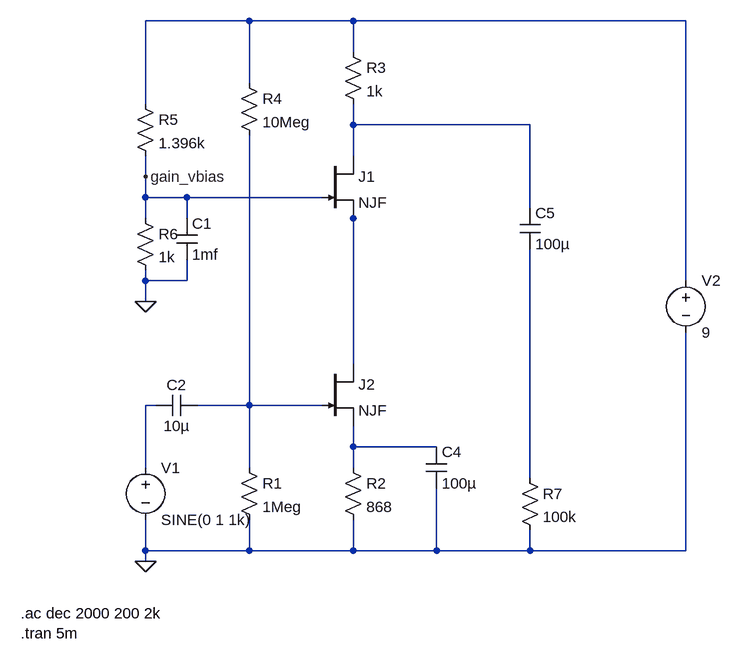
[diagram p0: schematic mixer_jfet_cascode.asc]
mixer_jfet_cascode.asc, the LTspice schematic file:
Version 4
SHEET 1 956 852
WIRE 224 -96 64 -96
WIRE 384 -96 224 -96
WIRE 896 -96 384 -96
WIRE 384 -48 384 -96
WIRE 224 0 224 -96
WIRE 64 32 64 -96
WIRE 384 64 384 32
WIRE 656 64 384 64
WIRE 384 112 384 64
WIRE 64 144 64 112
WIRE 64 176 64 144
WIRE 128 176 64 176
WIRE 336 176 128 176
WIRE 656 192 656 64
WIRE 64 208 64 176
WIRE 128 208 128 176
WIRE 384 208 384 192
WIRE 64 304 64 288
WIRE 128 304 128 272
WIRE 128 304 64 304
WIRE 896 304 896 -96
WIRE 64 336 64 304
WIRE 384 432 384 208
WIRE 80 496 64 496
WIRE 224 496 224 80
WIRE 224 496 144 496
WIRE 336 496 224 496
WIRE 384 560 384 528
WIRE 512 560 384 560
WIRE 64 592 64 496
WIRE 224 592 224 496
WIRE 384 592 384 560
WIRE 656 608 656 256
WIRE 64 720 64 672
WIRE 224 720 224 672
WIRE 224 720 64 720
WIRE 384 720 384 672
WIRE 384 720 224 720
WIRE 512 720 512 624
WIRE 512 720 384 720
WIRE 656 720 656 688
WIRE 656 720 512 720
WIRE 896 720 896 384
WIRE 896 720 656 720
WIRE 64 736 64 720
FLAG 64 336 0
FLAG 64 736 0
FLAG 64 144 gain_vbias
SYMBOL cap 112 208 R0
SYMATTR InstName C1
SYMATTR Value 1mf
SYMBOL cap 144 480 R90
WINDOW 0 0 32 VBottom 2
WINDOW 3 32 32 VTop 2
SYMATTR InstName C2
SYMATTR Value 10µ
SYMBOL cap 496 560 R0
SYMATTR InstName C4
SYMATTR Value 100µ
SYMBOL cap 640 192 R0
SYMATTR InstName C5
SYMATTR Value 100µ
SYMBOL res 208 576 R0
SYMATTR InstName R1
SYMATTR Value 1Meg
SYMBOL voltage 64 576 R0
SYMATTR InstName V1
SYMATTR Value SINE(0 1 1k)
SYMATTR Value2 AC 1
SYMBOL res 368 576 R0
SYMATTR InstName R2
SYMATTR Value 868
SYMBOL res 368 -64 R0
SYMATTR InstName R3
SYMATTR Value 1k
SYMBOL res 208 -16 R0
SYMATTR InstName R4
SYMATTR Value 10Meg
SYMBOL res 48 16 R0
SYMATTR InstName R5
SYMATTR Value 1.396k
SYMBOL res 48 192 R0
SYMATTR InstName R6
SYMATTR Value 1k
SYMBOL res 640 592 R0
SYMATTR InstName R7
SYMATTR Value 100k
SYMBOL njf 336 112 R0
SYMATTR InstName J1
SYMBOL njf 336 432 R0
SYMATTR InstName J2
SYMBOL voltage 896 288 R0
SYMATTR InstName V2
SYMATTR Value 9
TEXT -128 816 Left 2 !.ac dec 2000 200 2k\n.tran 5m

The netlist it stands for:
* mixer_jfet_cascode.asc
C1 gain_vbias 0 1mf
C2 N005 N004 10µ
C4 N006 0 100µ
C5 N002 N007 100µ
R1 N005 0 1Meg
V1 N004 0 SINE(0 1 1k) AC 1
R2 N006 0 868
R3 N001 N002 1k
R4 N001 N005 10Meg
R5 N001 gain_vbias 1.396k
R6 gain_vbias 0 1k
R7 N007 0 100k
J1 N002 gain_vbias N003 NJF
J2 N003 N005 N006 NJF
V2 N001 0 9
.model NJF NJF
.model PJF PJF
.lib standard.jft
.ac dec 2000 200 2k
.tran 5m
.backanno
.end